# EasyEDA Pro project _Stratus-Hackpad_.epro, schematic Stratus Hackpad

## Sheets
1 MCU: Board Name: Stratus Hackpad; Create Date: 2026-03-22; Page Name: MCU; Project Name: Stratus-Hackpad; Schematic Name: Stratus Hackpad; Update Date: 2026-03-22; Company: Dhruvin Sarkar; Drawn: Dhruvin Sarkar; Page Size: A3; Part Number: JLCPCB-002; Reviewed: EasyEDA; Version: V1.0
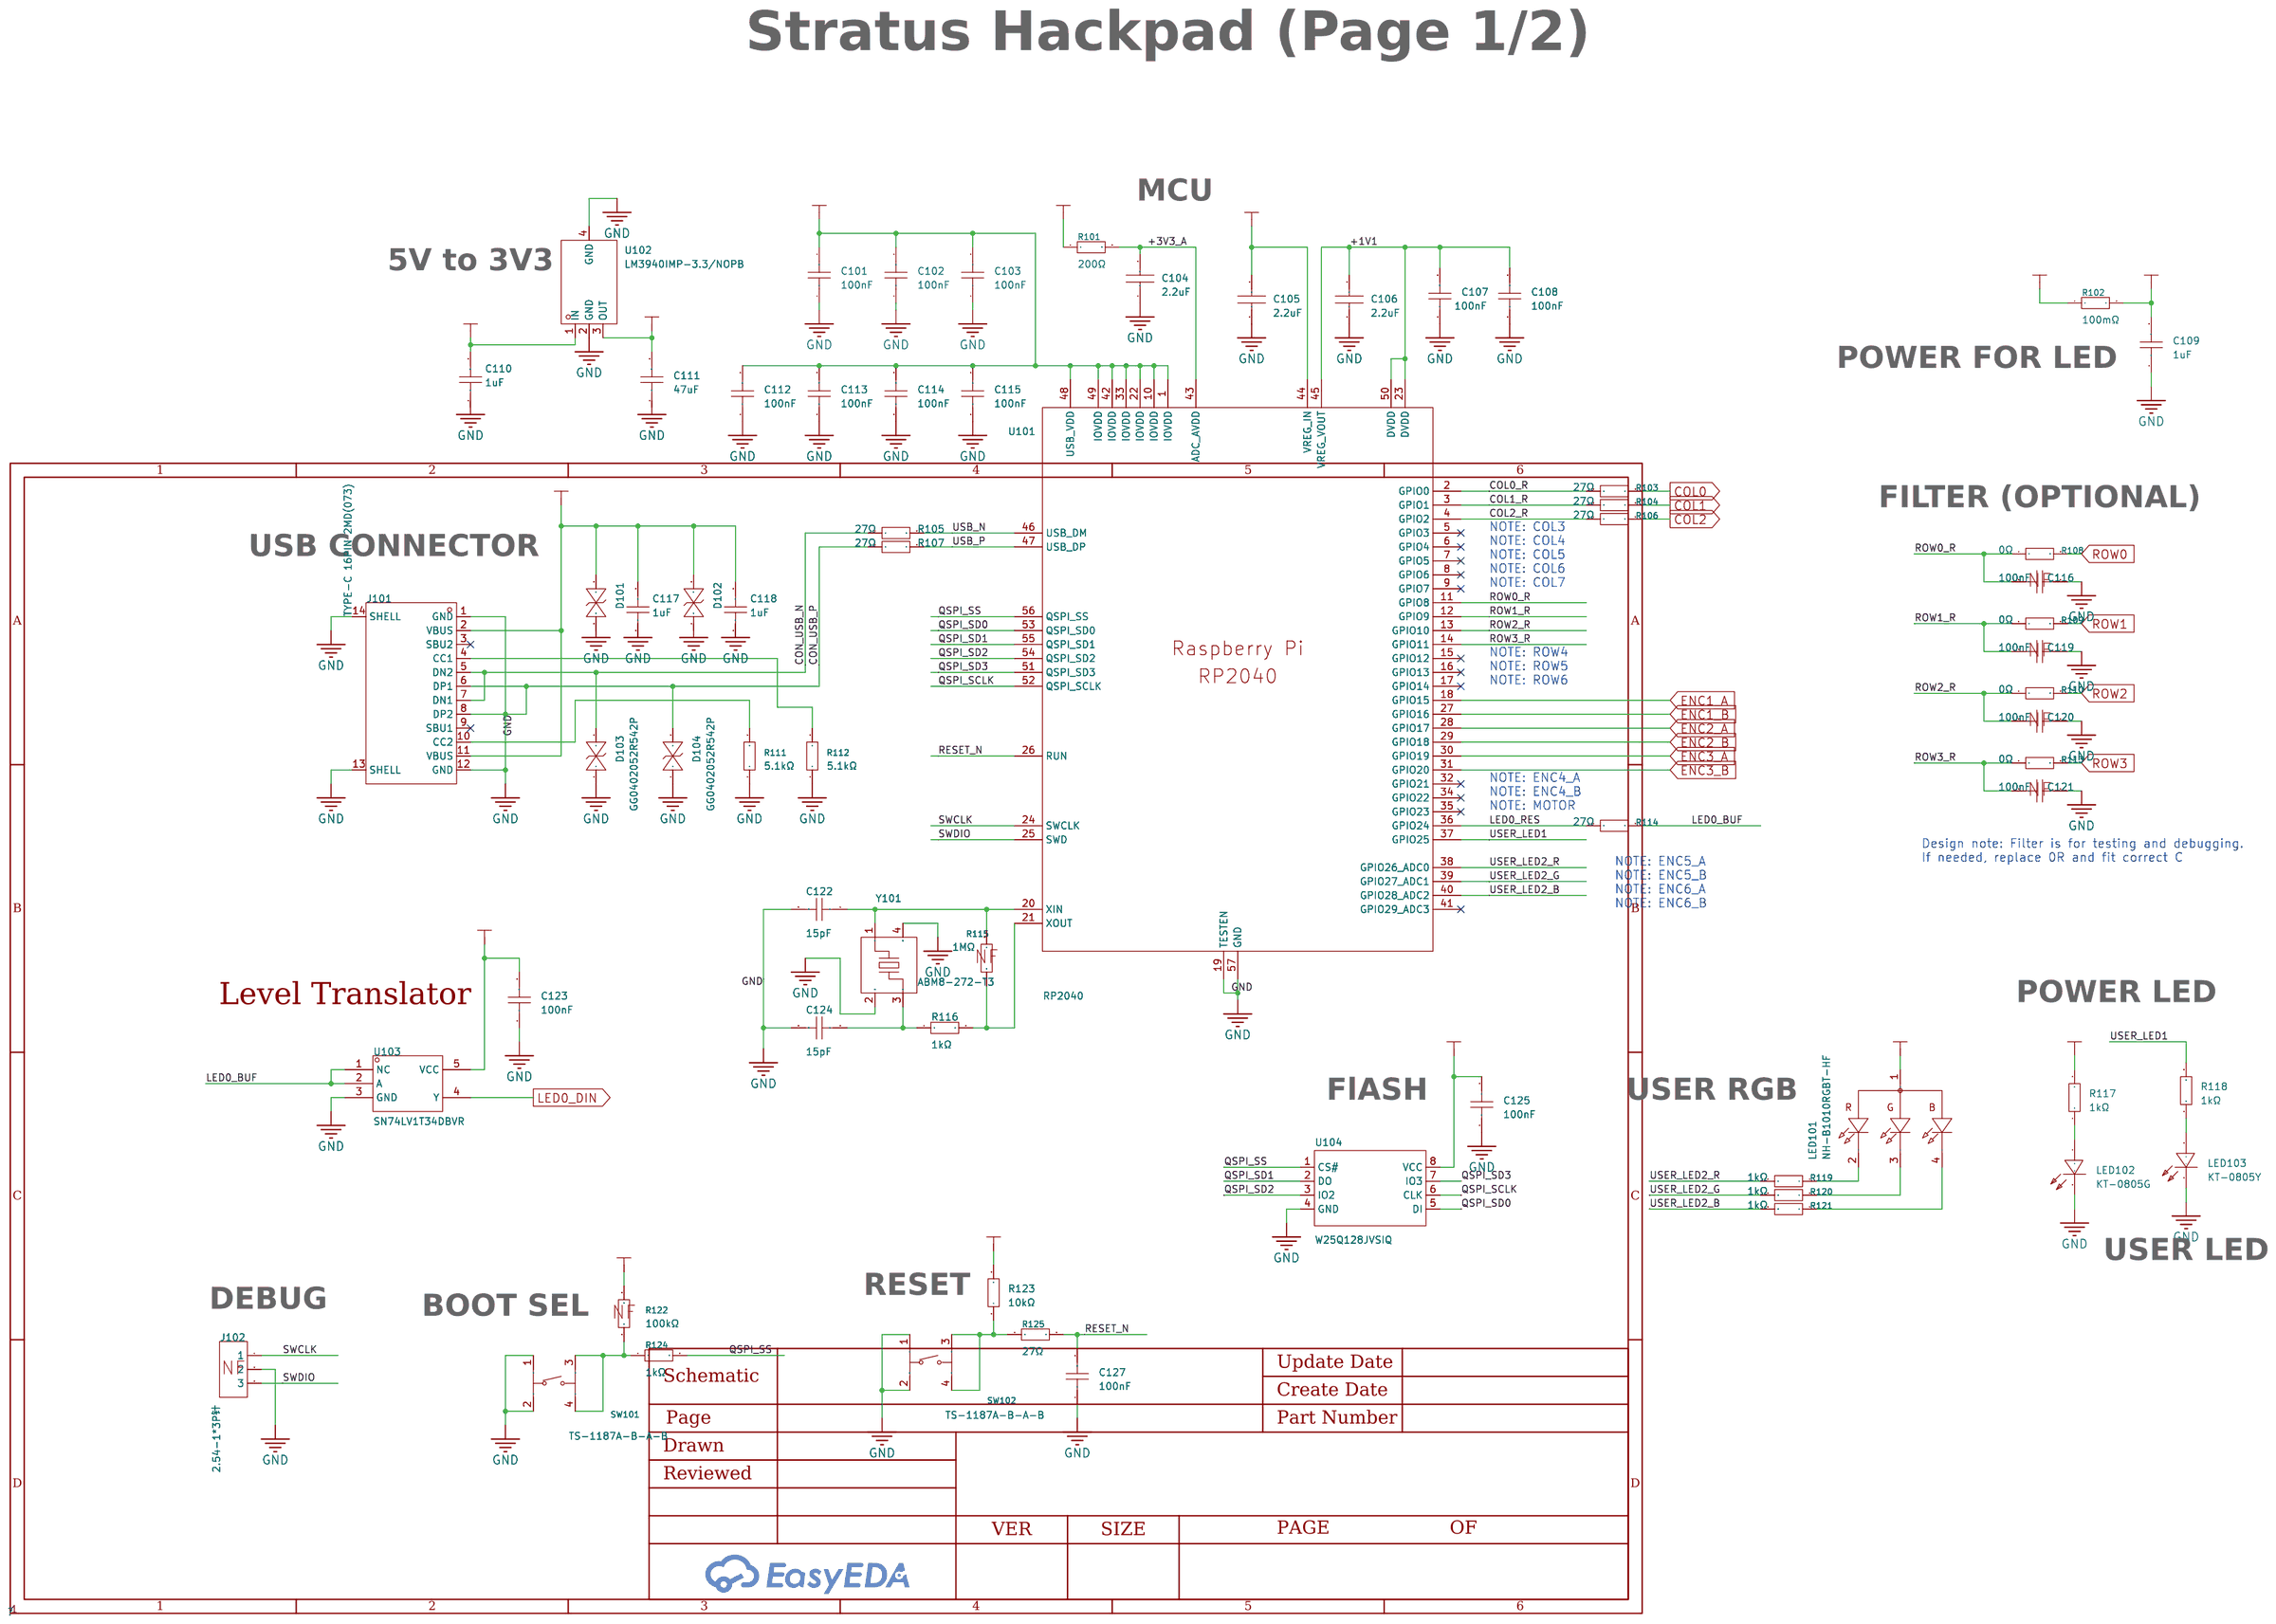
[diagram p0: MCU]
2 OTHER: Page Name: OTHER
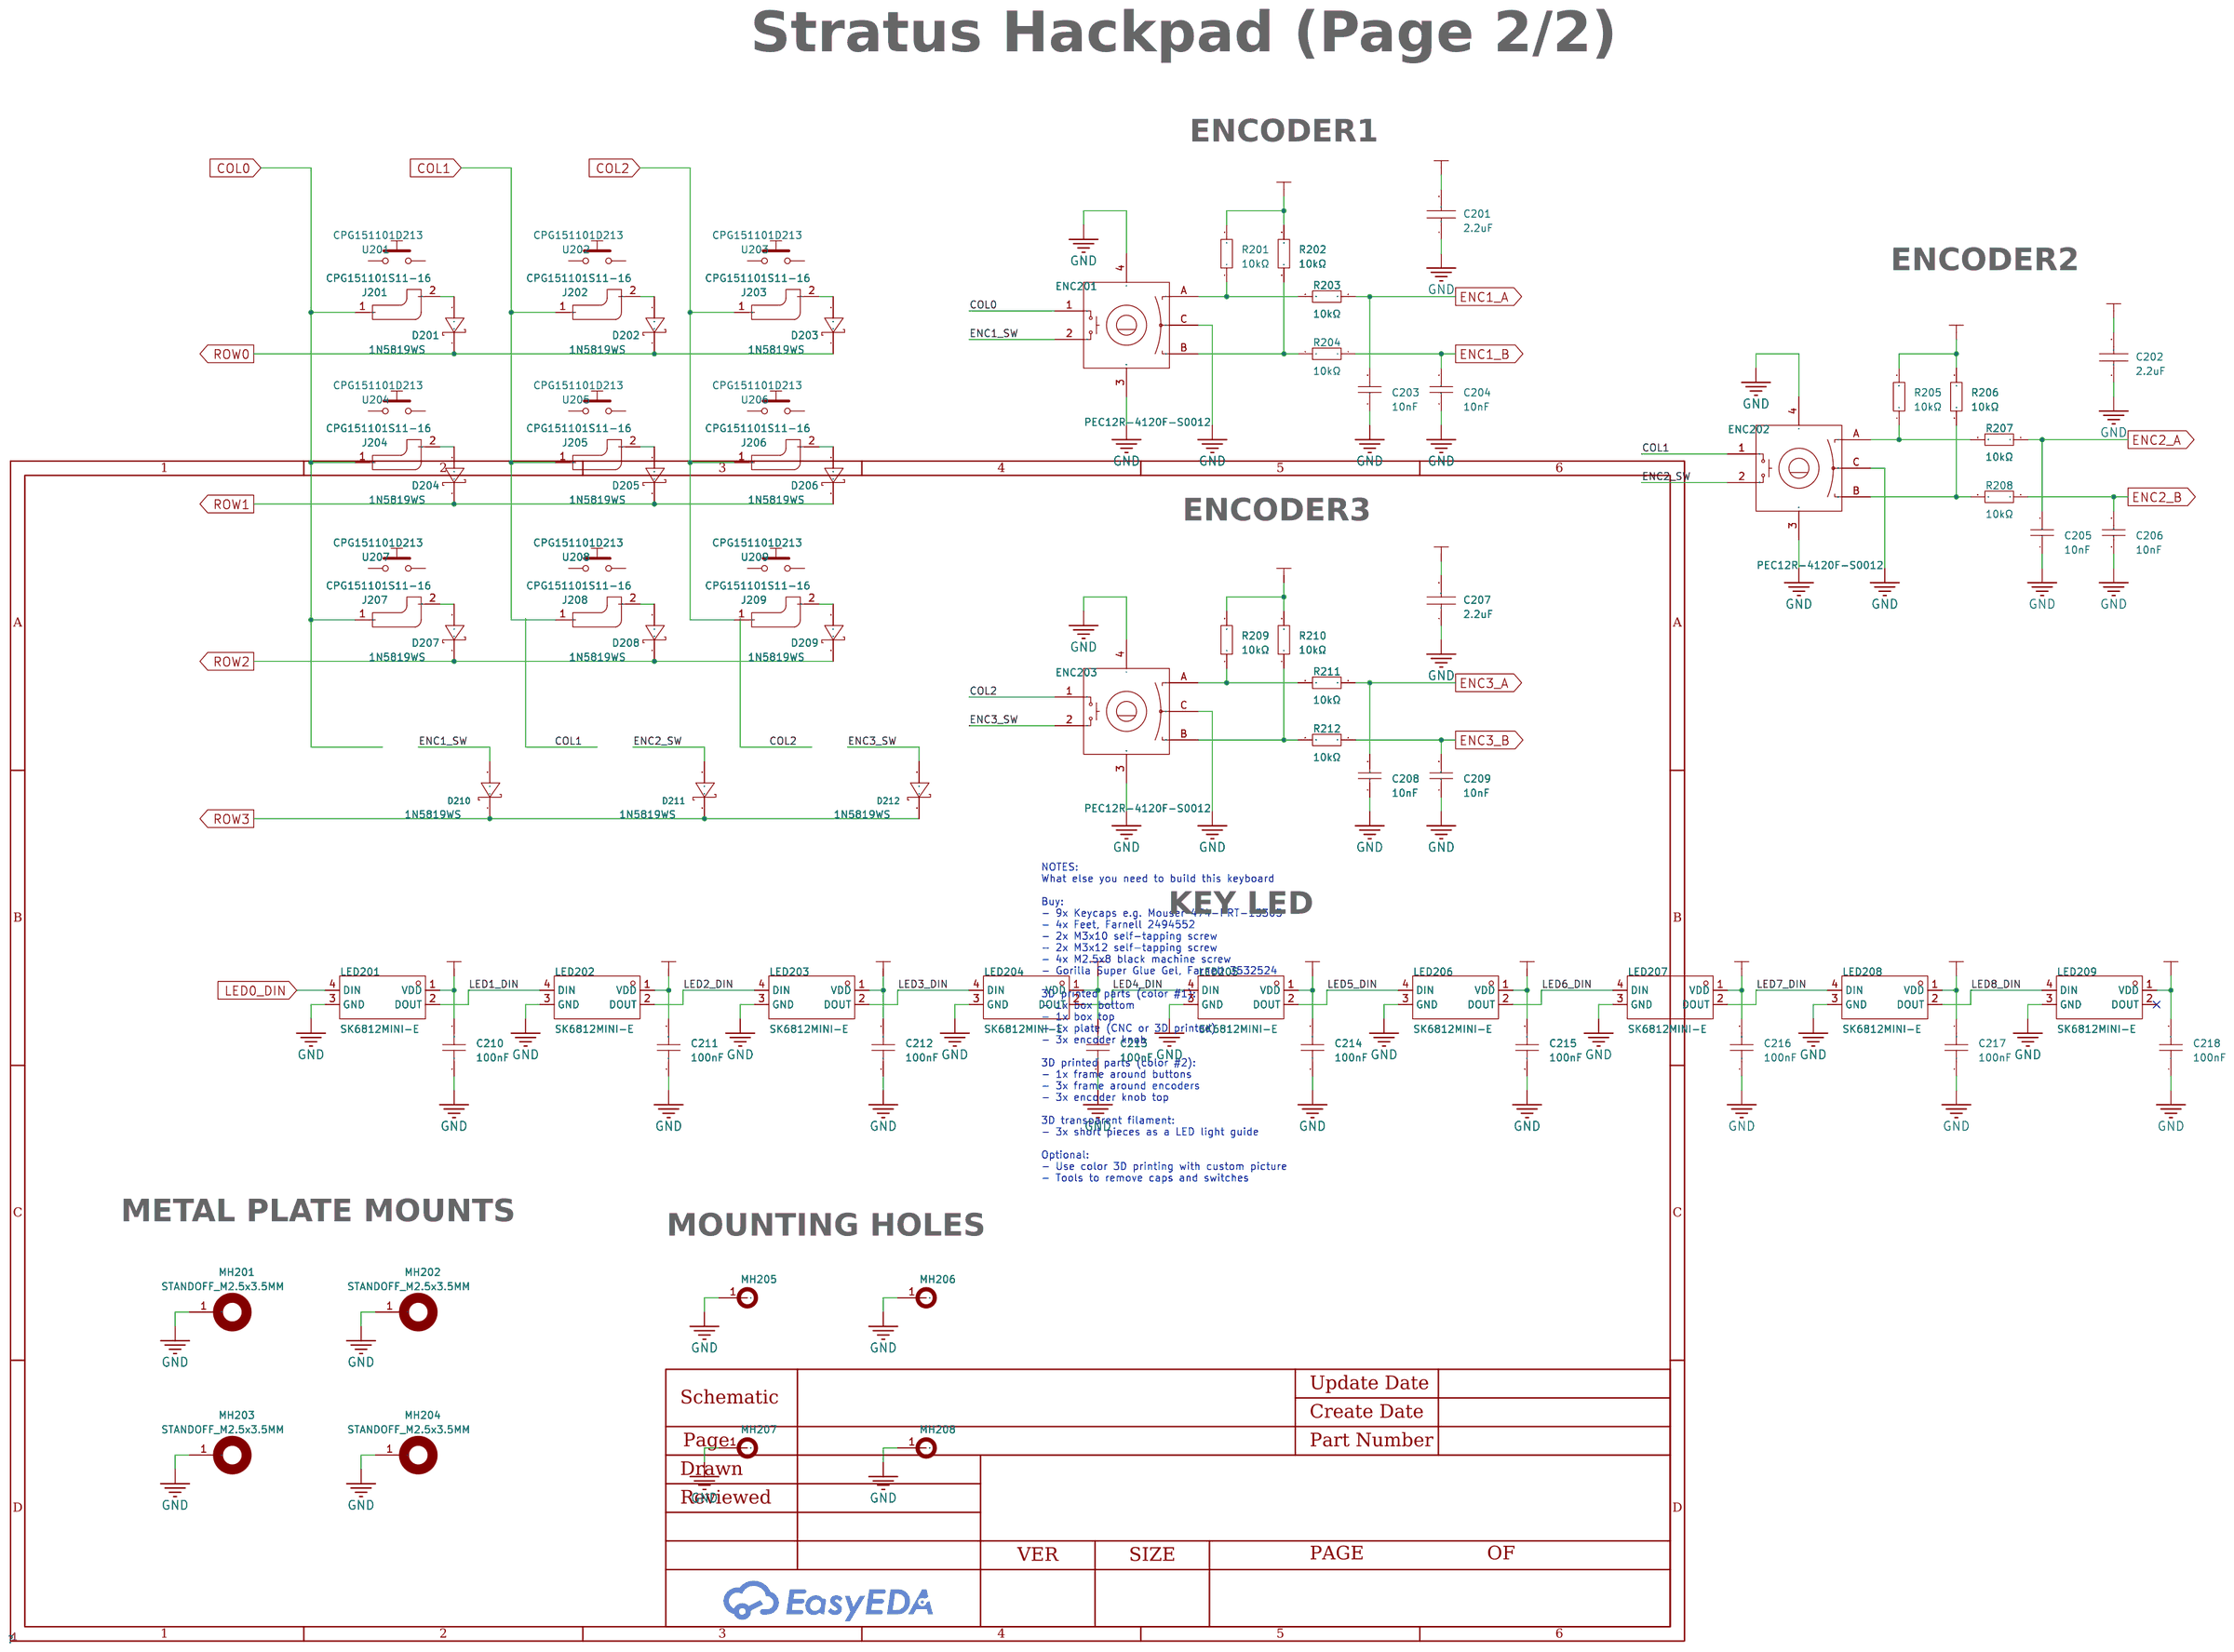
[diagram p1: OTHER]

## Parts
sheet MCU
C101  100nF  [C0402]
C102  100nF  [C0402]
C103  100nF  [C0402]
C104  2.2uF  [C0402]
C105  2.2uF  [C0402]
C106  2.2uF  [C0402]
C107  100nF  [C0402]
C108  100nF  [C0402]
C109  1uF  [C0402]
C110  1uF  [C0402]
C111  47uF  [C1206]
C112  100nF  [C0402]
C113  100nF  [C0402]
C114  100nF  [C0402]
C115  100nF  [C0402]
C116  100nF  [C0402]  (no BOM)
C117  1uF  [C0402]
C118  1uF  [C0402]
C119  100nF  [C0402]  (no BOM)
C120  100nF  [C0402]  (no BOM)
C121  100nF  [C0402]  (no BOM)
C122  15pF  [C0402]
C123  100nF  [C0402]
C124  15pF  [C0402]
C125  100nF  [C0402]
C127  100nF  [C0402]
D101  GG0402052R542P  [D0402-BI]
D102  GG0402052R542P  [D0402-BI]
D103  GG0402052R542P  [D0402-BI]
D104  GG0402052R542P  [D0402-BI]
J101  TYPE-C 16PIN 2MD(073)  [USB-C-SMD_TYPE-C-6PIN-2MD-073]
J102  2.54-1*3P针  [HDR-TH_3P-P2.54-V-M-1]  (no BOM)
LED101  NH-B1010RGBT-HF  [LED-ARRAY-SMD_4P-L1.0-W1.0-TR_NH-B1010RGBT_1]
LED102  KT-0805G  [LED0805-R-RD]
LED103  KT-0805Y  [LED0805-R-RD]
R101  200Ω  [R0402]
R102  100mΩ  [R1206]
R103  27Ω  [R0402]
R104  27Ω  [R0402]
R105  27Ω  [R0402]
R106  27Ω  [R0402]
R107  27Ω  [R0402]
R108  0Ω  [R0402]
R109  0Ω  [R0402]
R110  0Ω  [R0402]
R111  5.1kΩ  [R0402]
R112  5.1kΩ  [R0402]
R113  0Ω  [R0402]
R114  27Ω  [R0402]
R115  1MΩ  [R0402]  (no BOM)
R116  1kΩ  [R0402]
R117  1kΩ  [R0402]
R118  1kΩ  [R0402]
R119  1kΩ  [R0402]
R120  1kΩ  [R0402]
R121  1kΩ  [R0402]
R122  100kΩ  [R0402]  (no BOM)
R123  10kΩ  [R0402]
R124  1kΩ  [R0402]
R125  27Ω  [R0402]
SW101  TS-1187A-B-A-B  [SW-SMD_4P-L5.1-W5.1-P3.70-LS6.5-TL-2]
SW102  TS-1187A-B-A-B  [SW-SMD_4P-L5.1-W5.1-P3.70-LS6.5-TL-2]
U101  RP2040  [LQFN-56_L7.0-W7.0-P0.4-EP_1]
U102  LM3940IMP-3.3/NOPB  [SOT-223_L6.5-W3.5-P2.30-LS7.0-BR]
U103  SN74LV1T34DBVR  [SOT-23-5_L2.9-W1.6-P0.95-LS2.8-BR]
U104  W25Q128JVSIQ  [SOIC-8_L5.3-W5.3-P1.27-LS8.0-BL]
Y101  12MHz  [CRYSTAL-SMD_4P-L3.2-W2.5-BL]
sheet OTHER
C201  2.2uF  [C0402]
C202  2.2uF  [C0402]
C203  10nF  [C0402]
C204  10nF  [C0402]
C205  10nF  [C0402]
C206  10nF  [C0402]
C207  2.2uF  [C0402]
C208  10nF  [C0402]
C209  10nF  [C0402]
C210  100nF  [C0402]
C211  100nF  [C0402]
C212  100nF  [C0402]
C213  100nF  [C0402]
C214  100nF  [C0402]
C215  100nF  [C0402]
C216  100nF  [C0402]
C217  100nF  [C0402]
C218  100nF  [C0402]
D201  1N5819WS  [SOD-323_L1.8-W1.3-LS2.5-RD]
D202  1N5819WS  [SOD-323_L1.8-W1.3-LS2.5-RD]
D203  1N5819WS  [SOD-323_L1.8-W1.3-LS2.5-RD]
D204  1N5819WS  [SOD-323_L1.8-W1.3-LS2.5-RD]
D205  1N5819WS  [SOD-323_L1.8-W1.3-LS2.5-RD]
D206  1N5819WS  [SOD-323_L1.8-W1.3-LS2.5-RD]
D207  1N5819WS  [SOD-323_L1.8-W1.3-LS2.5-RD]
D208  1N5819WS  [SOD-323_L1.8-W1.3-LS2.5-RD]
D209  1N5819WS  [SOD-323_L1.8-W1.3-LS2.5-RD]
D210  1N5819WS  [SOD-323_L1.8-W1.3-LS2.5-RD]
D211  1N5819WS  [SOD-323_L1.8-W1.3-LS2.5-RD]
D212  1N5819WS  [SOD-323_L1.8-W1.3-LS2.5-RD]
ENC201  PEC12R-4120F-S0012  [SW-TH_PEC12R-4120F-S0012_1]
ENC202  PEC12R-4120F-S0012  [SW-TH_PEC12R-4120F-S0012_1]
ENC203  PEC12R-4120F-S0012  [SW-TH_PEC12R-4120F-S0012_1]
J201  CPG151101S11-16  [SMD_KEYBOARD-SW]
J202  CPG151101S11-16  [SMD_KEYBOARD-SW]
J203  CPG151101S11-16  [SMD_KEYBOARD-SW]
J204  CPG151101S11-16  [SMD_KEYBOARD-SW]
J205  CPG151101S11-16  [SMD_KEYBOARD-SW]
J206  CPG151101S11-16  [SMD_KEYBOARD-SW]
J207  CPG151101S11-16  [SMD_KEYBOARD-SW]
J208  CPG151101S11-16  [SMD_KEYBOARD-SW]
J209  CPG151101S11-16  [SMD_KEYBOARD-SW]
LED201  SK6812MINI-E  [LED-SMD_L3.2-W2.8-TR]
LED202  SK6812MINI-E  [LED-SMD_L3.2-W2.8-TR]
LED203  SK6812MINI-E  [LED-SMD_L3.2-W2.8-TR]
LED204  SK6812MINI-E  [LED-SMD_L3.2-W2.8-TR]
LED205  SK6812MINI-E  [LED-SMD_L3.2-W2.8-TR]
LED206  SK6812MINI-E  [LED-SMD_L3.2-W2.8-TR]
LED207  SK6812MINI-E  [LED-SMD_L3.2-W2.8-TR]
LED208  SK6812MINI-E  [LED-SMD_L3.2-W2.8-TR]
LED209  SK6812MINI-E  [LED-SMD_L3.2-W2.8-TR]
MH201  STANDOFF_M2.5x3.5MM  [STANDOFF_M2.5x3.5MM_RF_v1.0]
MH202  STANDOFF_M2.5x3.5MM  [STANDOFF_M2.5x3.5MM_RF_v1.0]
MH203  STANDOFF_M2.5x3.5MM  [STANDOFF_M2.5x3.5MM_RF_v1.0]
MH204  STANDOFF_M2.5x3.5MM  [STANDOFF_M2.5x3.5MM_RF_v1.0]
MH205  -  [MH_7.5X3.2MM_RF_v1.0]  (no BOM)
MH206  -  [MH_7.5X3.2MM_RF_v1.0]  (no BOM)
MH207  -  [MH_7.5X3.2MM_RF_v1.0]  (no BOM)
MH208  -  [MH_7.5X3.2MM_RF_v1.0]  (no BOM)
R201  10kΩ  [R0402]
R202  10kΩ  [R0402]
R203  10kΩ  [R0402]
R204  10kΩ  [R0402]
R205  10kΩ  [R0402]
R206  10kΩ  [R0402]
R207  10kΩ  [R0402]
R208  10kΩ  [R0402]
R209  10kΩ  [R0402]
R210  10kΩ  [R0402]
R211  10kΩ  [R0402]
R212  10kΩ  [R0402]
U201  CPG151101D213  [KEY-TH_CPG151101D21X]
U202  CPG151101D213  [KEY-TH_CPG151101D21X]
U203  CPG151101D213  [KEY-TH_CPG151101D21X]
U204  CPG151101D213  [KEY-TH_CPG151101D21X]
U205  CPG151101D213  [KEY-TH_CPG151101D21X]
U206  CPG151101D213  [KEY-TH_CPG151101D21X]
U207  CPG151101D213  [KEY-TH_CPG151101D21X]
U208  CPG151101D213  [KEY-TH_CPG151101D21X]
U209  CPG151101D213  [KEY-TH_CPG151101D21X]

## Library data of the parts
C101-C103 C107 C108 C112-C116 C119-C121 C123 C125 C210-C218 = CL05B104KO5NNNC: Capacitance: Tolerance:±10% Tolerance:±10% Voltage Rated: Temperature Coefficient:; LCSC Part Name: 100nF ±10% 16V; Supplier Part: C1525; Manufacturer: SAMSUNG(三星); Supplier Footprint: 0402; JLCPCB Part Class: Basic Part; Datasheet: https://atta.szlcsc.com/upload/public/pdf/source/20160218/1457707763339.pdf; Supplier: LCSC; Tolerance: ±10%; Temperature Coefficient: X7R; Voltage Rating: 16V
C104-C106 C201 C202 C207 = CL05A225MQ5NSNC: Capacitance: Tolerance:±20% Tolerance:±20% Voltage Rated: Temperature Coefficient:; LCSC Part Name: 2.2uF ±20% 6.3V; Supplier Part: C12530; Manufacturer: SAMSUNG(三星); Supplier Footprint: 0402; JLCPCB Part Class: Basic Part; Datasheet: https://atta.szlcsc.com/upload/public/pdf/source/20160218/1457707763339.pdf; Supplier: LCSC; Tolerance: ±20%; Temperature Coefficient: X5R; Voltage Rating: 6.3V
C109 C110 C117 C118 = CL05A105KA5NQNC: Capacitance: Tolerance:±10% Tolerance:±10% Voltage Rated: Temperature Coefficient:; LCSC Part Name: 1uF ±10% 25V; Supplier Part: C52923; Manufacturer: SAMSUNG(三星); Supplier Footprint: 0402; JLCPCB Part Class: Basic Part; Datasheet: https://atta.szlcsc.com/upload/public/pdf/source/20160218/1457707763339.pdf; Supplier: LCSC; Tolerance: ±10%; Temperature Coefficient: X5R; Voltage Rating: 25V
C111 = CL31A476MPHNNNE: Capacitance: Tolerance:±20% Tolerance:±20% Voltage Rated: Temperature Coefficient:; LCSC Part Name: 47uF ±20% 10V; Supplier Part: C96123; Manufacturer: SAMSUNG(三星); Supplier Footprint: 1206; JLCPCB Part Class: Basic Part; Datasheet: https://atta.szlcsc.com/upload/public/pdf/source/20160218/1457707763339.pdf; Supplier: LCSC; Tolerance: ±20%; Temperature Coefficient: X5R; Voltage Rating: 10V
C122 C124 = CL05C150JB5NNNC: Capacitance: Tolerance:±5% Tolerance:±5% Voltage Rated: Temperature Coefficient:; LCSC Part Name: 15pF ±5% 50V; Supplier Part: C86285; Manufacturer: SAMSUNG(三星); Supplier Footprint: 0402; JLCPCB Part Class: Extended Part; Datasheet: https://atta.szlcsc.com/upload/public/pdf/source/20160218/1457707763339.pdf; Supplier: LCSC; Tolerance: ±5%; Temperature Coefficient: C0G; Voltage Rating: 50V
C127 = CL05B104KO5NNNC: Capacitance: Tolerance:±10% Tolerance:±10% Voltage Rated: Temperature Coefficient:; LCSC Part Name: 100nF ±10% 16V; Supplier Part: C1525; Manufacturer: SAMSUNG(三星); Supplier Footprint: 0402; JLCPCB Part Class: Basic Part; Datasheet: https://atta.szlcsc.com/upload/public/pdf/source/20160218/1457707763339.pdf; Supplier: LCSC; Tolerance: ±10%
D101-D104 = GG0402052R542P: Reverse Stand-Off Voltage (Vrwm):5V Maximum Clamping Voltage:15.5V Peak Pulse Current (Ipp)@10/1000us:3A@8/20us Peak Pulse Power Dissipation (Ppp)@10/1000us:46W Breakdown Voltage:5.5V Type:TVS; LCSC Part Name: TVS 5V截止 3A峰值脉冲; Supplier Part: C1973257; Manufacturer: Kyocera AVX; Supplier Footprint: 0402; JLCPCB Part Class: Extended Part; Datasheet: https://atta.szlcsc.com/upload/public/pdf/source/20230915/02C5CA4E262376923D9117899A14A9C6.pdf; Supplier: LCSC; Reverse Stand-Off Voltage (Vrwm): 5V; Maximum Clamping Voltage: 15.5V; Peak Pulse Current (Ipp)@10/1000us: 3A@8/20us; Peak Pulse Power Dissipation (Ppp)@10/1000us: 46W; Breakdown Voltage: 5.5V; Type: TVS; Clamping Voltage: 15.5V; Peak Pulse Current (Ipp): 3A@8/20us; Peak Pulse Power Dissipation (Ppp): 46W@8/20us; Voltage - Breakdown: 5.5V; Reverse Leakage Current (Ir): 100nA; Operating Temperature: -55℃~+125℃; level of protection: IEC 61000-4-4；IEC 61000-4-2; Junction Capacitance: 2.5pF
J101 = TYPE-C 16PIN 2MD(073): Connector Type:Type-C Standard:USB 3.1 Gender:Female Mounting Style:Horizontal attachment Number of Contacts:16P Number of Ports:1 Current Rating - Power (Max):5A Operating Temperature Range:-25℃~+85℃ Operating Temperature Range:-25℃~+85℃ Rated Voltage (M; LCSC Part Name: Type-C 母 卧贴; Supplier Part: C2765186; Manufacturer: SHOU HAN(首韩); Supplier Footprint: SMD; JLCPCB Part Class: Extended Part; Datasheet: https://atta.szlcsc.com/upload/public/pdf/source/20211123/39B17C16241EAC15C5E277BDA434118E.pdf; Supplier: LCSC; Connector Type: Type-C; Standard: USB 3.1; Gender: Female; Mounting Style: Horizontal attachment; Number of Contacts: 16P; Number of Ports: 1; Current Rating - Power (Max): 5A; Operating Temperature Range: -25℃~+85℃; Rated Voltage (Max): 5V; Connect-Disconnect Life: 5000 Cuts; Core Colour: Black; Mounting Type: Surface Mount, Right Angle; Current Rating-Power: 3A; Voltage Rating: 5V; Detection color: Black; Operating Temperature: -25℃~+85℃
J102 = 2.54-1*3P针: Pin Structure:1x3P Pitch:2.54mm Row Spacing:- Circluar Pins/Square Pins:Square Pins Mounting Type:Straight Number of Rows:Plugin Number of Pins:3P Current Rating (Max):3A Voltage Rating (Max):- Length of Mating Pin:- Insulation Height:- Length of End Conn; LCSC Part Name: 间距:2.54mm 1x3P 直插 方针; Supplier Part: C49257; Manufacturer: BOOMELE(博穆精密); Supplier Footprint: 插件,P=2.54mm; JLCPCB Part Class: Extended Part; Datasheet: https://atta.szlcsc.com/upload/public/pdf/source/20221018/3E9408392E35E6F57A28985E5F7BF5C9.pdf; Supplier: LCSC; Pin Structure: 1x3P; Pitch: 2.54mm; Circluar Pins/Square Pins: Square Pins; Mounting Type: Straight; Number of Rows: Plugin; Number of Pins: 3P; Current Rating (Max): 3A; Contact Material: Brass; Operating Temperature Range: -40℃~+105℃; Color: Black; Current Rating: 3A; Operating Temperature: -40℃~+105℃
LED101 = NH-B1010RGBT-HF_RF_v1.0: Diode Configuration:Common Anode Dominant Wavelength:R:620nm；G:530nm；B:470nm Luminous Intensity:R:18mcd；G:25mcd；B:4.5mcd Viewing Angle:120° Forward Current:B:2mA；G:2mA；R:5mA Forward Voltage:R:2V；G:2.6V；B:2.7V Installation Method:Positive Stick Operating T; Supplier Part: C2874113; Manufacturer: 国星光电; Supplier Footprint: SMD-4P,1x1mm; Datasheet: https://atta.szlcsc.com/upload/public/pdf/source/20210810/0B2E174735C36A18A5A2783CB3D0373F.pdf; Supplier: LCSC; Diode Configuration: Common Anode; Dominant Wavelength: R:620nm；G:530nm；B:470nm; Luminous Intensity: R:18mcd；G:25mcd；B:4.5mcd; Viewing Angle: 120°; Forward Current: B:2mA；G:2mA；R:5mA; Forward Voltage: R:2V；G:2.6V；B:2.7V; Installation Method: Positive Stick; Operating Temperature: -30℃~+85℃
LED102 = KT-0805G: Lamp Holder Type:- Emitted Color:Emerald Forward Voltage (VF):- Forward Voltage (VF):- Power Dissipation:- Forward Current:- Dominant Wavelength:- Dominant Wavelength:- Peak Wavelength:- Diode Configuration:- Lens Color:- Color Temperature:- Color Tempera; LCSC Part Name: 0805 翠绿 高亮; Supplier Part: C2297; Manufacturer: KENTO; Supplier Footprint: 0805; JLCPCB Part Class: Basic Part; Datasheet: https://atta.szlcsc.com/upload/public/pdf/source/20170209/1486607340485.pdf; Supplier: LCSC; Emitted Color: Emerald; Illumination Color: Emerald Green; Voltage - Forward(Vf): 2.6V~3.1V; Power(Watts): 100mW; Wavelength - Dominant: 513nm~528nm
LED103 = KT-0805Y: Emitted Color:Yellow Power Dissipation:- Forward Current:- Dominant Wavelength:- Dominant Wavelength:- Peak Wavelength:- Diode Configuration:- Lens Color:- Color Temperature:- Color Temperature:- Viewing Angle:- Mounting Sytle:- Operating Temperature:- Op; LCSC Part Name: 0805 黄灯 高亮; Supplier Part: C2296; Manufacturer: KENTO; Supplier Footprint: 0805; JLCPCB Part Class: Basic Part; Datasheet: https://atta.szlcsc.com/upload/public/pdf/source/20160421/1461205044170.pdf; Supplier: LCSC; Emitted Color: Yellow; Illumination Color: Yellow; Voltage - Forward(Vf): 1.8V~2.4V; Power(Watts): 40mW; Wavelength - Dominant: 584nm~594nm; Luminous Intensity: 175mcd
R101 = 0402WGF2000TCE: Type:Thick Film Resistors Resistance: Tolerance:±1% Tolerance:±1% Power(Watts): Overload Voltage (Max): Temperature Coefficient:±100ppm/℃ Temperature Coefficient:±100ppm/℃ Operating Temperature Range:-55℃~+155℃ Operating Temperature Range:-55℃~+155℃; LCSC Part Name: 200Ω ±1% 62.5mW 厚膜电阻; Supplier Part: C25087; Manufacturer: UNI-ROYAL(厚声); Supplier Footprint: 0402; JLCPCB Part Class: Basic Part; Datasheet: https://atta.szlcsc.com/upload/public/pdf/source/20200306/C422600_1E6D84923E4A46A82E41ADD87F860B5C.pdf; Supplier: LCSC; Type: Thick Film Resistors; Tolerance: ±1%; Power(Watts): 62.5mW; Temperature Coefficient: ±100ppm/℃; Operating Temperature Range: -55℃~+155℃; Voltage-Supply(Max): 50V; Operating Temperature: -55℃~+155℃
R102 = 1206W4F100LT5E: Type:Thick Film Resistors Resistance:100mΩ Tolerance:±1% Tolerance:±1% Power(Watts): Overload Voltage (Max): Temperature Coefficient:±800ppm/℃ Temperature Coefficient:±800ppm/℃ Operating Temperature Range:-55℃~+155℃ Operating Temperature Range:-55℃~+155℃; LCSC Part Name: 100mΩ ±1% 250mW 厚膜电阻; Supplier Part: C25334; Manufacturer: UNI-ROYAL(厚声); Supplier Footprint: 1206; JLCPCB Part Class: Basic Part; Datasheet: https://atta.szlcsc.com/upload/public/pdf/source/20200306/C422600_1E6D84923E4A46A82E41ADD87F860B5C.pdf; Supplier: LCSC; Type: Thick Film Resistors; Tolerance: ±1%; Temperature Coefficient: ±800ppm/℃; Operating Temperature Range: -55℃~+155℃
R103-R107 R114 = 0402WGF270JTCE: Type:Thick Film Resistors Resistance:27Ω Tolerance:±1% Tolerance:±1% Power(Watts): Overload Voltage (Max): Temperature Coefficient:±100ppm/℃ Temperature Coefficient:±100ppm/℃ Operating Temperature Range:-55℃~+155℃ Operating Temperature Range:-55℃~+155℃; LCSC Part Name: 27Ω ±1% 62.5mW 厚膜电阻; Supplier Part: C25100; Manufacturer: UNI-ROYAL(厚声); Supplier Footprint: 0402; JLCPCB Part Class: Extended Part; Datasheet: https://atta.szlcsc.com/upload/public/pdf/source/20200306/C422600_1E6D84923E4A46A82E41ADD87F860B5C.pdf; Supplier: LCSC; Type: Thick Film Resistors; Tolerance: ±1%; Power(Watts): 62.5mW; Temperature Coefficient: ±100ppm/℃; Operating Temperature Range: -55℃~+155℃; Voltage-Supply(Max): 50V; Operating Temperature: -55℃~+155℃
R108-R110 R113 = 0402WGF0000TCE: Type:Thick Film Resistors Resistance: Tolerance:±1% Tolerance:±1% Power(Watts): Overload Voltage (Max): Temperature Coefficient:±800ppm/℃ Temperature Coefficient:±800ppm/℃ Operating Temperature Range:-55℃~+155℃ Operating Temperature Range:-55℃~+155℃; LCSC Part Name: 0Ω ±1% 62.5mW 厚膜电阻; Supplier Part: C17168; Manufacturer: UNI-ROYAL(厚声); Supplier Footprint: 0402; JLCPCB Part Class: Basic Part; Datasheet: https://atta.szlcsc.com/upload/public/pdf/source/20200306/C422600_1E6D84923E4A46A82E41ADD87F860B5C.pdf; Supplier: LCSC; Type: Thick Film Resistors; Tolerance: ±1%; Temperature Coefficient: ±800ppm/℃; Operating Temperature Range: -55℃~+155℃
R111 R112 = 0402WGF5101TCE: Type:Thick Film Resistors Resistance:5.1kΩ Tolerance:±1% Tolerance:±1% Power(Watts): Overload Voltage (Max): Temperature Coefficient:±100ppm/℃ Temperature Coefficient:±100ppm/℃ Operating Temperature Range:-55℃~+155℃ Operating Temperature Range:-55℃~+155℃; LCSC Part Name: 5.1kΩ ±1% 62.5mW 厚膜电阻; Supplier Part: C25905; Manufacturer: UNI-ROYAL(厚声); Supplier Footprint: 0402; JLCPCB Part Class: Basic Part; Datasheet: https://atta.szlcsc.com/upload/public/pdf/source/20200306/C422600_1E6D84923E4A46A82E41ADD87F860B5C.pdf; Supplier: LCSC; Type: Thick Film Resistors; Tolerance: ±1%; Power(Watts): 62.5mW; Temperature Coefficient: ±100ppm/℃; Operating Temperature Range: -55℃~+155℃; Voltage-Supply(Max): 50V; Operating Temperature: -55℃~+155℃
R115 = 0402WGF1004TCE: Type:Thick Film Resistors Resistance:1MΩ Tolerance:±1% Tolerance:±1% Power(Watts): Overload Voltage (Max): Temperature Coefficient:±100ppm/℃ Temperature Coefficient:±100ppm/℃ Operating Temperature Range:-55℃~+155℃ Operating Temperature Range:-55℃~+155℃; LCSC Part Name: 1MΩ ±1% 62.5mW 厚膜电阻; Supplier Part: C26083; Manufacturer: UNI-ROYAL(厚声); Supplier Footprint: 0402; JLCPCB Part Class: Basic Part; Datasheet: https://atta.szlcsc.com/upload/public/pdf/source/20200306/C422600_1E6D84923E4A46A82E41ADD87F860B5C.pdf; Supplier: LCSC; Type: Thick Film Resistors; Tolerance: ±1%; Power(Watts): 62.5mW; Temperature Coefficient: ±100ppm/℃; Operating Temperature Range: -55℃~+155℃; Voltage-Supply(Max): 50V; Operating Temperature: -55℃~+155℃
R116-R121 = 0402WGF1001TCE: Type:Thick Film Resistors Resistance:1kΩ Tolerance:±1% Tolerance:±1% Power(Watts): Overload Voltage (Max): Temperature Coefficient:±100ppm/℃ Temperature Coefficient:±100ppm/℃ Operating Temperature Range:-55℃~+155℃ Operating Temperature Range:-55℃~+155℃; LCSC Part Name: 1kΩ ±1% 62.5mW 厚膜电阻; Supplier Part: C11702; Manufacturer: UNI-ROYAL(厚声); Supplier Footprint: 0402; JLCPCB Part Class: Basic Part; Datasheet: https://atta.szlcsc.com/upload/public/pdf/source/20200306/C422600_1E6D84923E4A46A82E41ADD87F860B5C.pdf; Supplier: LCSC; Type: Thick Film Resistors; Tolerance: ±1%; Power(Watts): 62.5mW; Temperature Coefficient: ±100ppm/℃; Operating Temperature Range: -55℃~+155℃; Voltage-Supply(Max): 50V; Operating Temperature: -55℃~+155℃
R122 = 0402WGF1003TCE: Type:Thick Film Resistors Resistance:100kΩ Tolerance:±1% Tolerance:±1% Power(Watts): Overload Voltage (Max): Temperature Coefficient:±100ppm/℃ Temperature Coefficient:±100ppm/℃ Operating Temperature Range:-55℃~+155℃ Operating Temperature Range:-55℃~+155℃; LCSC Part Name: 100kΩ ±1% 62.5mW 厚膜电阻; Supplier Part: C25741; Manufacturer: UNI-ROYAL(厚声); Supplier Footprint: 0402; JLCPCB Part Class: Basic Part; Datasheet: https://atta.szlcsc.com/upload/public/pdf/source/20200306/C422600_1E6D84923E4A46A82E41ADD87F860B5C.pdf; Supplier: LCSC; Type: Thick Film Resistors; Tolerance: ±1%; Temperature Coefficient: ±100ppm/℃; Operating Temperature Range: -55℃~+155℃
R123 R201-R212 = 0402WGF1002TCE: Type:Thick Film Resistors Resistance:10kΩ Tolerance:±1% Tolerance:±1% Power(Watts): Overload Voltage (Max): Temperature Coefficient:±100ppm/℃ Temperature Coefficient:±100ppm/℃ Operating Temperature Range:-55℃~+155℃ Operating Temperature Range:-55℃~+155℃; LCSC Part Name: 10kΩ ±1% 62.5mW 厚膜电阻; Supplier Part: C25744; Manufacturer: UNI-ROYAL(厚声); Supplier Footprint: 0402; JLCPCB Part Class: Basic Part; Datasheet: https://atta.szlcsc.com/upload/public/pdf/source/20200306/C422600_1E6D84923E4A46A82E41ADD87F860B5C.pdf; Supplier: LCSC; Type: Thick Film Resistors; Tolerance: ±1%; Temperature Coefficient: ±100ppm/℃; Operating Temperature Range: -55℃~+155℃
R124 = 0402WGF1001TCE: Type:Thick Film Resistors Resistance:1kΩ Tolerance:±1% Tolerance:±1% Power(Watts): Overload Voltage (Max): Temperature Coefficient:±100ppm/℃ Temperature Coefficient:±100ppm/℃ Operating Temperature Range:-55℃~+155℃ Operating Temperature Range:-55℃~+155℃; LCSC Part Name: 1kΩ ±1% 62.5mW 厚膜电阻; Supplier Part: C11702; Manufacturer: UNI-ROYAL(厚声); Supplier Footprint: 0402; JLCPCB Part Class: Basic Part; Datasheet: https://atta.szlcsc.com/upload/public/pdf/source/20200306/C422600_1E6D84923E4A46A82E41ADD87F860B5C.pdf; Supplier: LCSC; Type: Thick Film Resistors; Tolerance: ±1%; Temperature Coefficient: ±100ppm/℃; Operating Temperature Range: -55℃~+155℃
R125 = 0402WGF270JTCE: Type:Thick Film Resistors Resistance:27Ω Tolerance:±1% Tolerance:±1% Power(Watts): Overload Voltage (Max): Temperature Coefficient:±100ppm/℃ Temperature Coefficient:±100ppm/℃ Operating Temperature Range:-55℃~+155℃ Operating Temperature Range:-55℃~+155℃; LCSC Part Name: 27Ω ±1% 62.5mW 厚膜电阻; Supplier Part: C25100; Manufacturer: UNI-ROYAL(厚声); Supplier Footprint: 0402; JLCPCB Part Class: Extended Part; Datasheet: https://atta.szlcsc.com/upload/public/pdf/source/20200306/C422600_1E6D84923E4A46A82E41ADD87F860B5C.pdf; Supplier: LCSC; Type: Thick Film Resistors; Tolerance: ±1%; Temperature Coefficient: ±100ppm/℃; Operating Temperature Range: -55℃~+155℃
SW101 SW102 = TS-1187A-B-A-B: Circuit:SPST Actuator Style:Round Button Operating Force:160gf Mounting Style:Brick nogging Switch Length:5.1mm Switch Width:5.1mm Switch Height:1.5mm Strike Gundam:不带 Contact Current:50mA Voltage Rating (DC):12V Insulation Resistance:- Actuator/Cap Color; LCSC Part Name: 5.1*5.1*1.5mm 立贴 轻触开关; Supplier Part: C318884; Manufacturer: XKB Connectivity(中国星坤); Supplier Footprint: SMD; JLCPCB Part Class: Basic Part; Datasheet: https://atta.szlcsc.com/upload/public/pdf/source/20200227/C318890_053E50208A88A7BA1965D8746000774E.pdf; Supplier: LCSC; Circuit: SPST; Actuator Style: Round Button; Operating Force: 160gf; Mounting Style: Brick nogging; Switch Length: 5.1mm; Switch Width: 5.1mm; Switch Height: 1.5mm; Strike Gundam: 不带; Contact Current: 50mA; Voltage Rating (DC): 12V; Actuator/Cap Color: 金色; With Lamp: No; Mechanical Life: 10万次; Operating Temperature: -30℃~+85℃
U101 = RP2040_C2040_DS_v1.0: CPU Core:- CPU Maximum Speed:133MHz Number of I/O:30 ADC (Bit):12bit; Manufacturer: Raspberry Pi(树莓派); Supplier: LCSC; Supplier Part: C2040; LCSC Part Name: RP2040（RP2B2）; Supplier Footprint: LQFN-56(7x7); JLCPCB Part Class: Extended Part; Datasheet: https://item.szlcsc.com/datasheet/RP2040/2392.html; CPU Maximum Speed: 133MHz; Number of I/O: 30; ADC (Bit): 12bit
U102 = LM3940IMP-3.3/NOPB: Output Type:Fixed Maximum Input Voltage:7.5V Output Voltage:3.3V Output Voltage:3.3V Output Current:1A Power Supply Rejection Ratio (PSRR):- Dropout Voltage:200mV@(100mA) Feature:防静电保护；Short-Circuit  Protection；低ESR；Thermal Protection(TSD)；Overcurrent Pro; LCSC Part Name: 用于 5V 至 3.3V 电压转换的 1A 低压降稳压器; Supplier Part: C140319; Manufacturer: TI(德州仪器); Supplier Footprint: SOT-223; JLCPCB Part Class: Extended Part; Datasheet: https://www.ti.com/cn/lit/gpn/lm3940; Supplier: LCSC; Output Type: Fixed; Maximum Input Voltage: 7.5V; Output Voltage: 3.3V; Output Current: 1A; Dropout Voltage: 200mV@(100mA); Feature: 防静电保护；Short-Circuit  Protection；低ESR；Thermal Protection(TSD)；Overcurrent Protection(OCP)；带使能; Operating Temperature: -40℃~+125℃; Output Polarity: Positive electrode; Number of Outputs: 1; Voltage - Supply: 5.5V; Voltage Dropout: 500mV@(1A); standby current: 10mA; Noise: 250uVrms; Features: Over Current Protection；Short Circuit Protection；Over Temperature Protection; Output Configuration: Positive
U103 = SN74LV1T34DBVR_RF_v1.0: Input type:- output type:推挽 Supply Voltage:1.6V~5.5V Supply Voltage:1.6V~5.5V Number of Elements:1 Number of Bits per Element:1 Sink Current:8mA Source Current:8mA Logic Family:74LV Operating Temperature:-40℃~+125℃ Operating Temperature:-40℃~+125℃; Supplier Part: C100024; Manufacturer: TI(德州仪器); Supplier Footprint: SOT-23-5; Datasheet: https://www.ti.com/cn/lit/gpn/sn74lv1t34; Supplier: LCSC; output type: 推挽; Supply Voltage: 1.6V~5.5V; Number of Elements: 1; Number of Bits per Element: 1; Sink Current: 8mA; Source Current: 8mA; Logic Family: 74LV; Operating Temperature: -40℃~+125℃
U104 = W25Q128JVSIQ: Interface Type:- Memory Size:128Mbit Clock Frequency (fc):- Supply Voltage:- Supply Voltage:- Page Programming Time (Tpp):- Block Erase Time (tBE):- Data Retention - TDR (Year):- Operating Temperature:- Operating Temperature:-; LCSC Part Name: W25Q128JVSIQ 编带; Supplier Part: C97521; Manufacturer: WINBOND(华邦); Supplier Footprint: SOIC-8-208mil; JLCPCB Part Class: Basic Part; Datasheet: https://atta.szlcsc.com/upload/public/pdf/source/20170316/1489627409956.pdf; Supplier: LCSC; Memory Size: 128Mbit; Interface: SPI; Clock Frequency: 133MHz; Voltage - Supply: 2.7V~3.6V; Standby Supply Current: 1uA; Program / Erase Cycles: 100,000 Cycles; Block Erase Time(tBE): 120ms@(32KB)
Y101 = ABM8-272-T3_C20625731: Type:Crystal Oscillator Frequency:12MHz Normal temperature Frequency Tolerance:±30ppm Normal temperature Frequency Tolerance:±30ppm Load Capacitance:10pF Frequency Stability:±30ppm Frequency Stability:±30ppm Equivalent Series Resistance(ESR):50Ω Operating; LCSC Part Name: ABM8-272-T3; Supplier Part: C20625731; Manufacturer: ABRACON; Manufacturer Part: ABM8-272-T3; Supplier Footprint: SMD3225-4P; JLCPCB Part Class: Extended Part; Datasheet: https://atta.szlcsc.com/upload/public/pdf/source/20240227/A8BE43F636D80F75C9AF5C59EDF21E9A.pdf; Supplier: LCSC; Type: Crystal Oscillator; Normal temperature Frequency Tolerance: ±30ppm; Load Capacitance: 10pF; Frequency Stability: ±30ppm; Equivalent Series Resistance(ESR): 50Ω; Operating Temperature: -40℃~+85℃
C203-C206 C208 C209 = CL05B103KB5NNNC: Capacitance: Tolerance:±10% Tolerance:±10% Voltage Rated: Temperature Coefficient:; LCSC Part Name: 10nF ±10% 50V; Supplier Part: C15195; Manufacturer: SAMSUNG(三星); Supplier Footprint: 0402; JLCPCB Part Class: Basic Part; Datasheet: https://atta.szlcsc.com/upload/public/pdf/source/20160218/1457707763339.pdf; Supplier: LCSC; Tolerance: ±10%
D201-D212 = 1N5819WS_C191023: Forward Voltage (Vf@If):600mV@1A Reverse Voltage (Vr):40V Average Rectified Current (Io):1A; LCSC Part Name: 电压:40V 电流:1A; Supplier Part: C191023; Manufacturer: Hottech(合科泰); Supplier Footprint: SOD-323; JLCPCB Part Class: Basic Part; Datasheet: https://atta.szlcsc.com/upload/public/pdf/source/20220428/3CB86FD8D28D653594B4E35F9D5AEFD9.pdf; Supplier: LCSC; Forward Voltage (Vf@If): 600mV@1A; Reverse Voltage (Vr): 40V; Average Rectified Current (Io): 1A; Voltage - Forward(Vf@If): 600mV@1A; Voltage - DC Reverse(Vr): 40V; Current - Rectified: 1A; Non-Repetitive Peak Forward Surge Current: 25A
ENC201-ENC203 = PEC12R-4120F-S0012_RF_v1.0: Supplier Part: C143801; Manufacturer: BOURNS; Supplier Footprint: 插件; Datasheet: https://atta.szlcsc.com/upload/public/pdf/source/20220425/FDFEFF279D64F139C3201B9534523AD5.pdf; Supplier: LCSC
J201-J209 = CPG151101S11-16_DS_v1.0: Axis Type:- Operating Voltage:2V~12V Operating Voltage:2V~12V Pin:- Mechanical Life:- Operation Force:- Conduction Travel:- Total Travel:- Operating Temperature:- Operating Temperature:-; Manufacturer: Kailh(凯华); Supplier: LCSC; Supplier Part: C5156480; JLCPCB Part Class: Extended Part; Datasheet: https://atta.szlcsc.com/upload/public/pdf/source/20220829/33DFC1A320A078D20879F2B21562B513.pdf; Operating Voltage: 2V~12V
LED201-LED209 = SK6812MINI-E_C5149201: Supplier Part: C5149201; Manufacturer: 欧思科光电; Supplier Footprint: SMD; JLCPCB Part Class: Extended Part; Datasheet: https://atta.szlcsc.com/upload/public/pdf/source/20240708/7577C013CD62BC7D192EAA1AF5B38052.pdf; Supplier: LCSC
MH201-MH204 = 9774035151R_RF_v1.0: Standoff, Steel, M2.5, Hex Female-Female, 3.5 mm, 4.9 mm, WA-SMSI Series; Manufacturer: WURTH ELEKTRONIK; Supplier: FARNELL; Supplier Part: 3757968; Part Number: 9774035151R
MH205-MH208 = MH_7.5X3.2MM_RF_v1.0
U201-U209 = CPG151101D213_DS_v1.0: Axis Type:Copper Switch Number of Pins:2 Life:70,000,000 Cycles Operation Force:40gf@±10gf Conduction Travel:1.1mm Operating Temperature:- Operating Temperature:-; Manufacturer: Kailh(凯华); Supplier: LCSC; Supplier Part: C400235; LCSC Part Name: KS 铜轴; Supplier Footprint: 插件; JLCPCB Part Class: Extended Part; Datasheet: https://item.szlcsc.com/datasheet/CPG151101D213/384000.html; Axis Type: Copper Switch; Number of Pins: 2; Life: 70,000,000 Cycles; Operation Force: 40gf@±10gf; Conduction Travel: 1.1mm

## Nets
+1V1: C106.2 C107.2 C108.2 U101.23(DVDD) U101.45(VREG_VOUT) U101.50(DVDD)
+3V3: C101.2 C102.2 C103.2 C105.2 C111.2 C112.2 C113.2 C114.2 C115.2 C125.2 C201.2 C202.2 C207.2 LED101.1(+) R101.1 R117.2 R122.2 R123.2 R201.2 R202.2 R205.2 R206.2 R209.2 R210.2 U101.1(IOVDD) U101.10(IOVDD) U101.22(IOVDD) U101.33(IOVDD) U101.42(IOVDD) U101.44(VREG_IN) U101.48(USB_VDD) U101.49(IOVDD) U102.3(OUT) U104.8(VCC)
+3V3_A: C104.2 R101.2 U101.43(ADC_AVDD)
+5V_LEDS: C109.2 C210.2 C211.2 C212.2 C213.2 C214.2 C215.2 C216.2 C217.2 C218.2 LED201.1(VDD) LED202.1(VDD) LED203.1(VDD) LED204.1(VDD) LED205.1(VDD) LED206.1(VDD) LED207.1(VDD) LED208.1(VDD) LED209.1(VDD) R102.2
+5V_USB: C110.2 C117.2 C118.2 C123.2 D101.2 D102.2 J101.2(VBUS) J101.11(VBUS) R102.1 U102.1(IN) U103.5(VCC)
GND: C101.1 C102.1 C103.1 C104.1 C105.1 C106.1 C107.1 C108.1 C109.1 C110.1 C111.1 C112.1 C113.1 C114.1 C115.1 C116.1 C117.1 C118.1 C119.1 C120.1 C121.1 C122.2 C123.1 C124.2 C125.1 C127.1 C201.1 C202.1 C203.1 C204.1 C205.1 C206.1 C207.1 C208.1 C209.1 C210.1 C211.1 C212.1 C213.1 C214.1 C215.1 C216.1 C217.1 C218.1 D101.1 D102.1 D103.1 D104.1 ENC201.3 ENC201.4 ENC201.C ENC202.3 ENC202.4 ENC202.C ENC203.3 ENC203.4 ENC203.C J101.1(GND) J101.12(GND) J101.13(SHELL) J101.14(SHELL) J102.2 LED102.2(K) LED103.2(-) LED201.3(GND) LED202.3(GND) LED203.3(GND) LED204.3(GND) LED205.3(GND) LED206.3(GND) LED207.3(GND) LED208.3(GND) LED209.3(GND) MH201.1 MH202.1 MH203.1 MH204.1 MH205.1 MH206.1 MH207.1 MH208.1 R111.1 R112.1 SW101.1(A) SW101.2(B) SW102.1(A) SW102.2(B) U101.19(TESTEN) U101.57(GND) U102.2(GND) U102.4(GND) U103.3(GND) U104.4(GND) Y101.2(GND) Y101.4(GND)
COL0: ENC201.1 J201.1 J204.1 J207.1 R103.2
COL0_R: R103.1 U101.2(GPIO0)
COL1: ENC202.1 J202.1 J205.1 J208.1 R104.2
COL1_R: R104.1 U101.3(GPIO1)
COL2: ENC203.1 J203.1 J206.1 J209.1 R106.2
COL2_R: R106.1 U101.4(GPIO2)
CON_USB_N: D103.2 J101.5(DN2) J101.7(DN1) R105.1
CON_USB_P: D104.2 J101.6(DP1) J101.8(DP2) R107.1
ENC1_A: C203.2 R203.1 U101.18(GPIO15)
ENC1_B: C204.2 R204.1 U101.27(GPIO16)
ENC1_SW: D210.2(A) ENC201.2
ENC2_A: C205.2 R207.1 U101.28(GPIO17)
ENC2_B: C206.2 R208.1 U101.29(GPIO18)
ENC2_SW: D211.2(A) ENC202.2
ENC3_A: C208.2 R211.1 U101.30(GPIO19)
ENC3_B: C209.2 R212.1 U101.31(GPIO20)
ENC3_SW: D212.2(A) ENC203.2
LED0_BUF: R114.2 U103.1(NC) U103.2(A)
LED0_DIN: LED201.4(DIN) U103.4(Y)
LED0_RES: R114.1 U101.36(GPIO24)
LED1_DIN: LED201.2(DOUT) LED202.4(DIN)
LED2_DIN: LED202.2(DOUT) LED203.4(DIN)
LED3_DIN: LED203.2(DOUT) LED204.4(DIN)
LED4_DIN: LED204.2(DOUT) LED205.4(DIN)
LED5_DIN: LED205.2(DOUT) LED206.4(DIN)
LED6_DIN: LED206.2(DOUT) LED207.4(DIN)
LED7_DIN: LED207.2(DOUT) LED208.4(DIN)
LED8_DIN: LED208.2(DOUT) LED209.4(DIN)
QSPI_SCLK: U101.52(QSPI_SCLK) U104.6(CLK)
QSPI_SD0: U101.53(QSPI_SD0) U104.5(DI)
QSPI_SD1: U101.55(QSPI_SD1) U104.2(DO)
QSPI_SD2: U101.54(QSPI_SD2) U104.3(IO2)
QSPI_SD3: U101.51(QSPI_SD3) U104.7(IO3)
QSPI_SS: R124.2 U101.56(QSPI_SS) U104.1(CS#)
RESET_N: C127.2 R125.2 U101.26(RUN)
ROW0: D201.1(K) D202.1(K) D203.1(K) R108.2
ROW0_R: C116.2 R108.1 U101.11(GPIO8)
ROW1: D204.1(K) D205.1(K) D206.1(K) R109.2
ROW1_R: C119.2 R109.1 U101.12(GPIO9)
ROW2: D207.1(K) D208.1(K) D209.1(K) R110.2
ROW2_R: C120.2 R110.1 U101.13(GPIO10)
ROW3: D210.1(K) D211.1(K) D212.1(K) R113.2
ROW3_R: C121.2 R113.1 U101.14(GPIO11)
SWCLK: J102.1 U101.24(SWCLK)
SWDIO: J102.3 U101.25(SWD)
USB_N: R105.2 U101.46(USB_DM)
USB_P: R107.2 U101.47(USB_DP)
USER_LED1: R118.2 U101.37(GPIO25)
USER_LED2_B: R121.2 U101.40(GPIO28_ADC2)
USER_LED2_G: R120.2 U101.39(GPIO27_ADC1)
USER_LED2_R: R119.2 U101.38(GPIO26_ADC0)
$1N8227: R122.1 R124.1 SW101.3(C) SW101.4(D)
$1N8669: R123.1 R125.1 SW102.3(C) SW102.4(D)
$2N527: D201.2(A) J201.2
$2N632: D202.2(A) J202.2
$2N737: D203.2(A) J203.2
$2N1048: D204.2(A) J204.2
$2N1050: D205.2(A) J205.2
$2N1052: D206.2(A) J206.2
$2N1363: D207.2(A) J207.2
$2N1365: D208.2(A) J208.2
$2N1367: D209.2(A) J209.2
$2N3267: ENC203.A R209.1 R211.2
$2N3271: ENC203.B R210.1 R212.2
Net-(C122-1): C122.1 R115.2 U101.20(XIN) Y101.1
Net-(C124-1): C124.1 R116.1 Y101.3
Net-(ENC201-A): ENC201.A R201.1 R203.2
Net-(ENC201-B): ENC201.B R202.1 R204.2
Net-(ENC202-A): ENC202.A R205.1 R207.2
Net-(ENC202-B): ENC202.B R206.1 R208.2
Net-(J101-4): J101.4(CC1) R112.2
Net-(J101-10): J101.10(CC2) R111.2
Net-(LED101-2): LED101.2(-) R119.1
Net-(LED101-3): LED101.3(-) R120.1
Net-(LED101-4): LED101.4(-) R121.1
Net-(LED102-1): LED102.1(A) R117.1
Net-(LED103-1): LED103.1(+) R118.1
Net-(R115-1): R115.1 R116.2 U101.21(XOUT)

Not connected (* = marked no-connect by the designer): J101 3(SBU2)* 9(SBU1)*; LED209 2(DOUT)*; U101 5(GPIO3)* 6(GPIO4)* 7(GPIO5)* 8(GPIO6)* 9(GPIO7)* 15(GPIO12)* 16(GPIO13)* 17(GPIO14)* 32(GPIO21)* 34(GPIO22)* 35(GPIO23)* 41(GPIO29_ADC3)*

## Notes on the sheets
sheet 1
- Stratus Hackpad (Page 1/2)
- MCU
- 5V to 3V3
- POWER FOR LED
- FILTER (OPTIONAL)
- NOTE: COL3
- USB CONNECTOR
- NOTE: COL4
- NOTE: COL5
- NOTE: COL6
- NOTE: COL7
- NF
- NOTE: ROW4
- NF
- NOTE: ROW5
- NOTE: ROW6
- NF
- NOTE: ENC4_A
- NF
- NOTE: ENC4_B
- NOTE: MOTOR
- Design note: Filter is for testing and debugging.
  If needed, replace 0R and fit correct C
- NOTE: ENC5_A
- NOTE: ENC5_B
- NOTE: ENC6_A
- NOTE: ENC6_B
- NF
- Level Translator
- POWER LED
- FlASH
- USER RGB
- USER LED
- RESET
- DEBUG
- BOOT SEL
- NF
- NF
sheet 2
- Stratus Hackpad (Page 2/2)
- ENCODER1
- ENCODER2
- ENCODER3
- KEY LED
- NOTES:
  What else you need to build this keyboard
  Buy:
  - 9x Keycaps e.g. Mouser 474-PRT-15305
  - 4x Feet, Farnell 2494552
  - 2x M3x10 self-tapping screw
  - 2x M3x12 self-tapping screw
  - 4x M2.5x8 black machine screw
  - Gorilla Super Glue Gel, Farnell 3532524
  3D printed parts (color #1):
  - 1x box bottom
  - 1x box top
  - 1x plate (CNC or 3D printed)
  - 3x encoder knob
  3D printed parts (color #2):
  - 1x frame around buttons
  - 3x frame around encoders
  - 3x encoder knob top
  3D transparent filament:
  - 3x short pieces as a LED light guide
  Optional:
  - Use color 3D printing with custom picture
  - Tools to remove caps and switches
- METAL PLATE MOUNTS
- MOUNTING HOLES
